# EAGLE design max6675 (EAGLE 5.01)
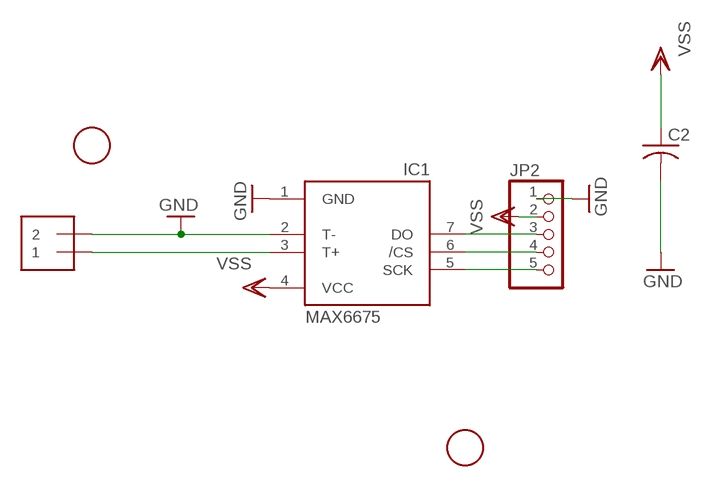
[diagram p0: schematic, sheet 1]

## Parts
C2  C-USC0805K  [C0805K]
IC1  MAX6675  [SO08]
J1  1X2-3.5MM  [3.5MMTERM]
JP2  PINHD-1X5  [1X05]
U$1  FIDUCIAL  [FIDUCIAL_1MM]
U$2  FIDUCIAL  [FIDUCIAL_1MM]

## Nets
CS: IC1.6(/CS) JP2.4
CSK: IC1.5(SCK) JP2.5
DO: IC1.7(DO) JP2.3
GND: C2.2 IC1.1(GND) IC1.2(T-) J1.2 JP2.1
N$1: IC1.3(T+) J1.1
VSS: C2.1 IC1.4(VCC) JP2.2

## Library data of the parts
C2 = adafruit:C-US: CAPACITOR, American symbol
IC1 = adafruit:MAX6675
J1 = adafruit:1X2: 3.5mm Terminal block http://www.ladyada.net/library/pcb/eaglelibrary.html
JP2 = pinhead:PINHD-1X5: PIN HEADER
U$1 U$2 = adafruit:FIDUCIAL: For use by pick and place machines to calibrate the vision/machine, 1mm By microbuilder.eu

## Board
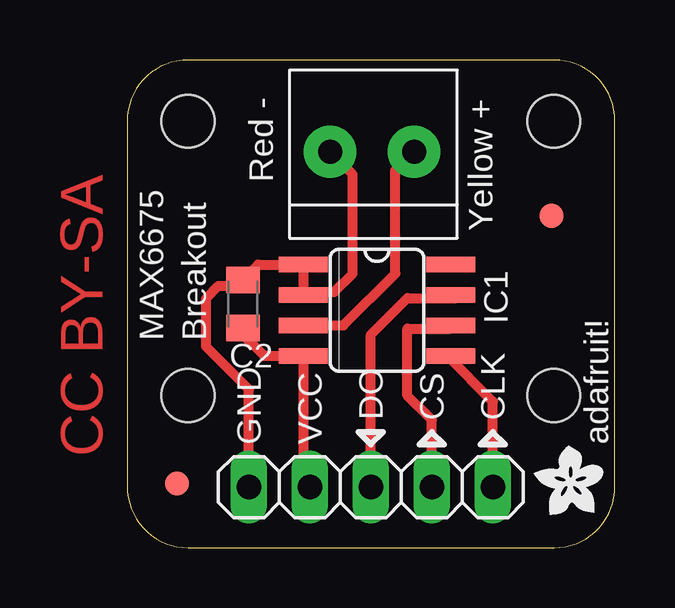
[diagram p1: board, top side]

Size 20.33 x 20.32 mm. Coordinates in mm from the lower left corner, seen from the top.
Outline: 20.32,17.78 arc90 17.79,20.32 2.54,20.32 arc90 0,17.78 0,2.54 arc90 2.54,0 17.79,0 arc90 20.32,2.54 20.32,17.78
Copper layers (1*16): Top 0.035mm / dielectric 1.5mm / Bottom 0.035mm
Design rules "default": minimum track width 10mil, minimum drill 19mil, track to track 8mil, track to pad 8mil, pad to pad 8mil, via to via 8mil, smd to smd 8mil, copper to edge 10mil, drill to drill 8mil, minimum pad ring 10mil, minimum via ring 8mil, stop-mask expansion 4mil, vias tented up to drill 21mil, thermal gap 10mil
Holes 2.2 mm at 2.54,6.34 17.78,6.34 17.78,17.77 2.54,17.77

### Footprints (pad centres in the part's own frame; a part is rotated, then mirrored left to right if it is on the bottom)
C0805K = smd 1.1 x 1.4: 1 -1,0; 2 1,0
SO08 = smd 0.66 x 2.032: 1 -1.905,-3.073; 2 -0.635,-3.073; 3 0.635,-3.073; 4 1.905,-3.073; 5 1.905,3.073; 6 0.635,3.073; 7 -0.635,3.073; 8 -1.905,3.073
3.5MMTERM = drill 1 pad 2.184 round: 1 1.8,0; 2 -1.7,0
1X05 = drill 1.016 long: 1 -5.08,0; 2 -2.54,0; 3 0,0; 4 2.54,0; 5 5.08,0
FIDUCIAL_1MM = smd 1 x 1: 1 0,0

### Placement (x,y rotation side)
C2  4.82,10.15 90 top
IC1  10.41,9.89 270 top
J1  10.15,16.5 0 top
JP2  10.15,2.53 0 top
U$1  2.08,2.68 0 top
U$2  17.67,13.83 0 top
U$3  [ADAFRUIT200MIL]  18.28,2.78 0 top

### Tracks (layer width: path | path; a pad name or v marks a point on that pad's centre or on a via)
CS
  Top 0.406: IC1.6 13.48,9.16 13.46,9.13 11.68,9.13 11.68,6.34 12.69,5.32 JP2.4
CSK
  Top 0.406: IC1.5 13.33,7.99 15.23,6.08 JP2.5
DO
  Top 0.406: IC1.7 13.58,10.53 13.71,10.4 11.68,10.4 10.15,8.88 JP2.3 10.15,2.27
GND
  Top 0.406: 4.82,11.16 5.46,11.8 IC1.1 7.36,11.8 | JP2.1 5.08,6.59 3.3,8.37 3.3,10.4 3.81,10.91 4.57,10.91 4.82,11.16 | 4.82,11.16 C2.2 | J1.2 9.39,15.56 9.39,11.42 8.63,10.66 7.36,10.66 | 7.36,10.66 7.36,10.55 IC1.2 | 7.36,11.93 7.36,11.8 | 7.36,10.66 7.36,11.8
N$1
  Top 0.406: IC1.3 9.01,9.26 11.17,11.42 11.17,15.74 11.93,16.5 J1.1
VSS
  Top 0.406: C2.1 4.58,9.15 4.57,9.13 5.71,7.99 IC1.4 7.36,7.96 7.36,2.78 JP2.2

### Text on the board
Top: CC BY-SA
tPlace: Red - | Yellow + | MAX6675 | Breakout | DO | CS | CLK | GND | VCC | adafruit!